# Altium schematic sheet Tem sensor hot air.SchDoc
size A4; SheetNumber: 8; SheetTotal: 8
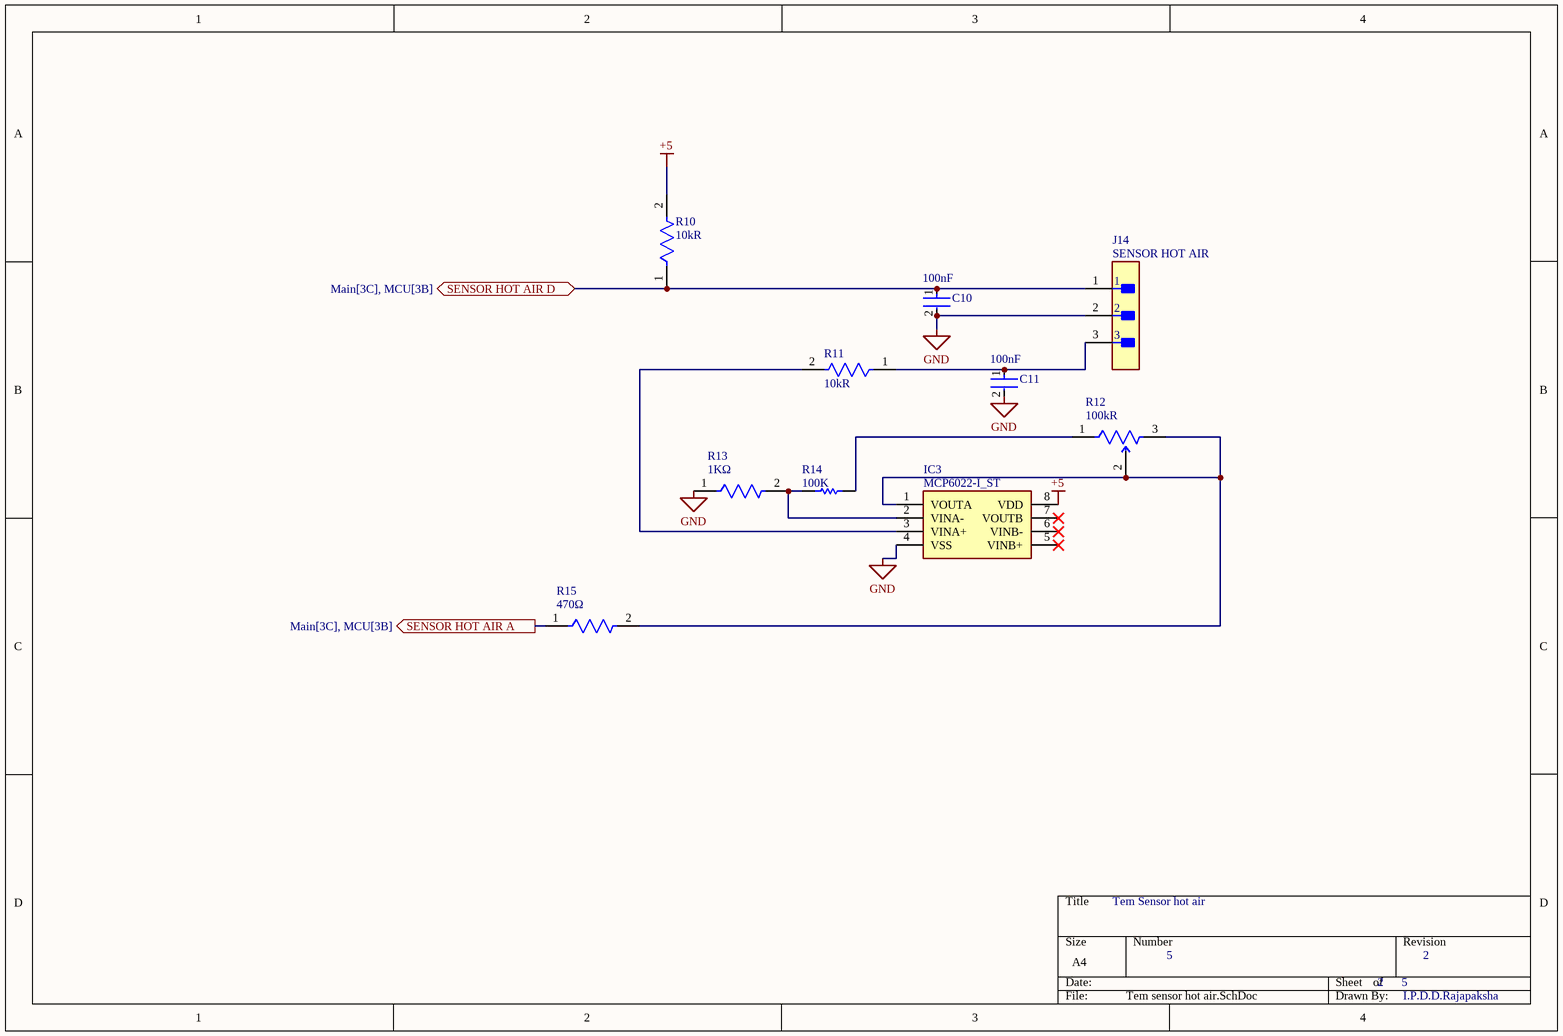
[diagram p0: Tem sensor hot air.SchDoc]

## Parts
C10  Capacitance: 100nF  [FP-0805-L_2_01_0_2-W_1_25-IPC_A]  (hidden comment: 0805YC104M4T2A)
C11  Capacitance: 100nF  [FP-0805-L_2_01_0_2-W_1_25-IPC_A]  (hidden comment: 0805YC104M4T2A)
IC3  MCP6022-I_ST  [SOP65P640X120-8N]
J14  Parameter 1: SENSOR HOT AIR  [FP-B3B-XH-A_LF_SN-MFG]  (hidden comment: B3B-XH-A(LF)(SN))
R10  Resistance: 10kR  [FP-CRCW1206-e3-IPC_C]  (hidden comment: CRCW120610K0FKEA)
R11  Resistance: 10kR  [FP-CRCW1206-e3-IPC_C]  (hidden comment: CRCW120610K0FKEA)
R12  Resistance: 100kR  [FP-67W-MFG]  (hidden comment: 67WR100KLF)
R13  value 1KΩ  [FP-CRGCQ1206-IPC_C]  (hidden comment: CRGCQ1206F1K0)
R14  Parameter 1: 100K  [RESC3216X60X45NL10T20]  (hidden comment: CRCW1206100KFKEA)
R15  value 470Ω  [FP-CRGCQ1206-IPC_C]  (hidden comment: CRGCQ1206F470R)

## Ports
SENSOR HOT AIR A (out, see Main[3C], MCU[3B]), SENSOR HOT AIR D (bidir, see Main[3C], MCU[3B])

## Nets
+5: IC3.8(VDD) R10.2
GND: C10.2 C11.2 IC3.4(VSS) J14.2 R13.1
SENSOR HOT AIR A: R15.1 ; port SENSOR HOT AIR A
SENSOR HOT AIR D: C10.1 J14.1 R10.1 ; port SENSOR HOT AIR D
NetC11_1: C11.1 J14.3 R11.1
NetIC3_1: IC3.1(VOUTA) R12.2 R12.3 R15.2
NetIC3_2: IC3.2(VINA-) R13.2 R14.1
NetIC3_3: IC3.3(VINA+) R11.2
NetR12_1: R12.1 R14.2

Not connected (* = marked no-connect by the designer): IC3 5(VINB+)* 6(VINB-)* 7(VOUTB)*

## Notes on the sheet
- Tem Sensor hot air
- 5
- 2      5
- 2
- I.P.D.D.Rajapaksha

## Library data of the parts
C10 C11 = CMP-04427-015812-1: Automotive Ceramic Capacitor, 0805, 100nF, 20%, X7R, 0.15, 16V; Termination: SMD/SMT; Case Code (Metric): 2012; Length: 0.079inch; Dielectric: X7R; Max Operating Temperature: 125°C; Thickness: 0.037inch; Ratings: AEC-Q200; Package Quantity: 4000; Weight: 0.000194oz; Voltage Rating: 16V; Voltage Rating (DC): 16V; Mount: Surface Mount; Width: 1.25mm; Packaging: Tape and Reel; Tolerance: 20%; Case/Package: 0805; Height: 0.94mm; Case Code (Imperial): 0805; Min Operating Temperature: -55°C
IC3 = MCP6022-I_ST: Integrated Circuit; Manufacturer_Name: Microchip; Manufacturer_Part_Number: MCP6022-I/ST; Datasheet Link: https://datasheet.datasheetarchive.com/originals/distributors/Datasheets-DGA24/1612719.pdf; Height: 1.2mm; Mouser Part Number: 579-MCP6022-I/ST; Mouser Price/Stock: https://www.mouser.co.uk/ProductDetail/Microchip-Technology/MCP6022-I-ST?qs=cQYLKLPzRJmFw784uzHvww%3D%3D; Arrow Part Number: MCP6022-I/ST; Arrow Price/Stock: https://www.arrow.com/en/products/mcp6022-ist/microchip-technology?region=europe
J14 = CMP-17439-000014-3: CONN HEADER VERT 3POS 2.5MM; Max Voltage Rating (DC): 250V; Number of Positions: 3; Current Rating: 3A; Gender: Male; Wire/Cable Gauge: 22AWG; Contact Resistance: 20mR; Insulation Resistance: 1GR; AC PCB: POT; Insulation Material: Nylon; Contact Plating: Tin; Depth: 5.75mm; Contact Type: Male Pin; Max Operating Temperature: 85°C; Insulation Color: Natural; Voltage Rating (AC): 250V; Color: Natural; Connector Type: Header; Orientation: Straight; Fastening Type: Detent; Housing Color: White; Min Operating Temperature: -25°C; Termination: Solder; Voltage Rating: 250V; Series: XH; Pitch: 2.5mm; Contact Shape: Square; Number of Rows: 1; Lead Free: Lead Free; Packaging: Bulk; Mount: Through Hole; Flammability Rating: UL94 V-0; Max Voltage Rating (AC): 250V; REACH SVHC: No SVHC; Housing Material: Polyamide; Contact Material: Brass; Lead Pitch: 2.5mm; Contact Finish - Mating: TIN; Length: 9.9mm; Max Current Rating: 3A; Number of Contacts: 3
R10 R11 = CMP-2003-04807-2: RES Thick Film, 10kΩ, 1%, 0.25W, 100ppm/°C, 1206; Working Voltage: 200V; Max Power Dissipation: 250mW; Tolerance: 1%; Width: 0.063inch; Height: 0.55mm; Number of Pins: 2; Voltage Rating: 200V; Temperature Coefficient: 100ppm/°C; Military Standard: Not; Features: Automotive AEC-Q200; Depth: 1.6mm; Radiation Hardening: No; Termination: SMD/SMT; Case Code (Imperial): 1206; Weight: 0.000353oz; Length: 3.2mm; Package Quantity: 10; Voltage Rating (DC): 200V; Case/Package: 1206; Min Operating Temperature: -55°C; Number of Terminations: 2; Composition: Thick Film; Contact Plating: Tin; Power Rating: 250mW; Packaging: Tape and Reel; Max Operating Temperature: 155°C; Lead Free: Lead Free; Case Code (Metric): 3216
R12 = CMP-50449-000002-1: TRIMMER 100K OHM 0.5W PC PIN TOP; Power Rating: 500mW; Temperature Coefficient: 100ppm/°C; Number of Turns: 20; Voltage Rating: 200V; Tolerance: 10%; Radiation Hardening: No; Min Operating Temperature: -55°C; Packaging: Bulk; Depth: 4.95mm; Resistor Type: Cermet; Mount: Through Hole; Max Power Dissipation: 500mW; Package Quantity: 100; Length: 9.53mm; REACH SVHC: No SVHC; Voltage Rating (DC): 200V; Series: 67; Height: 0.409inch; Type: Potentiometer; Weight: 1.1g; RoHS Compliant: Yes; Technology: CERMET; Lead Free: Lead Free; Termination: Pin; Resistance Tolerance: 10%; Max Operating Temperature: 125°C; Military Standard: Not
R13 = CMP-03211-006592-1: CRGCQ1206 1KΩ 0.25W 1% ±100ppm/°C 200V; Manufacturer: TE Connectivity; Automotive Grade: Grade 685; Tolerance: 0.01; Ipc Land Pattern Name: RESC310155X55; Temperature Range Low: -55°C; Device Class L3: Chip SMD Resistors; ComponentLink2URL: https://www.te.com/commerce/DocumentDelivery/DDEController?Action=showdoc&DocId=Data+Sheet%7F1773204-3%7F1%7Fpdf%7FEnglish%7FENG_DS_1773204-3_1.pdf%7F4-2176347-694; Automotive: Yes; Temperature: -55°C to +155°C; Manufacturer Part Number: CRGCQ1206F1K0; Package: CRGCQ1206; Octopart: https://octopart.com/crgcq1206f1k0-te+connectivity-91018258; Device Class L1: Passive Components; Series: CRGCQ; Device Class L2: Resistors; RoHS: TRUE; Lead Free: Yes; ComponentLink2Description: Datasheet; Power Rating: 0.25W; Temperature Coefficient: ±100ppm/°C; Voltage Rating: 200V; Temperature Range High: +155°C; Height: 0.65mm; Category: Res; Resistance: 1KΩ; Composition: Thick Film; Ambient Temperature Range High: +70°C
R14 = CMP-1014-00736-2: Manufacturer: Vishay Dale; Part Number: CRCW1206100KFKEA
R15 = CMP-03211-011147-1: CRGCQ 1206 470R 1%; Manufacturer: TE Connectivity; Power Rating: 0.25W; Tolerance: 0.01; Automotive Grade: Grade 609; Voltage Rating: 200V; Temperature Coefficient: ±100ppm/°C; Octopart: https://octopart.com/crgcq1206f470r-te+connectivity-91018284; Manufacturer Part Number: CRGCQ1206F470R; ComponentLink2Description: Datasheet; Device Class L3: Chip SMD Resistors; Temperature Range High: +155°C; Device Class L1: Passive Components; Ipc Land Pattern Name: RESC310155X55; Ambient Temperature Range High: +70°C; RoHS: TRUE; Series: CRGCQ; Height: 0.65mm; Digikey Description: CRGCQ 1206 470R 1%; Package: CRGCQ1206; Composition: Thick Film; Lead Free: Yes; Resistance: 470Ω; Automotive: Yes; Category: Res; Temperature Range Low: -55°C; ComponentLink2URL: https://www.te.com/commerce/DocumentDelivery/DDEController?Action=showdoc&DocId=Data+Sheet%7F1773204-3%7F1%7Fpdf%7FEnglish%7FENG_DS_1773204-3_1.pdf%7F4-2176347-618; Device Class L2: Resistors; Temperature: -55°C to +155°C; Mouser Description: Res General Purpose Thick Film 1206 470 Ohm 1% 1/4W ±100ppm/°C Molded Paper T/R